# EAGLE design uC (EAGLE 7.7.0)
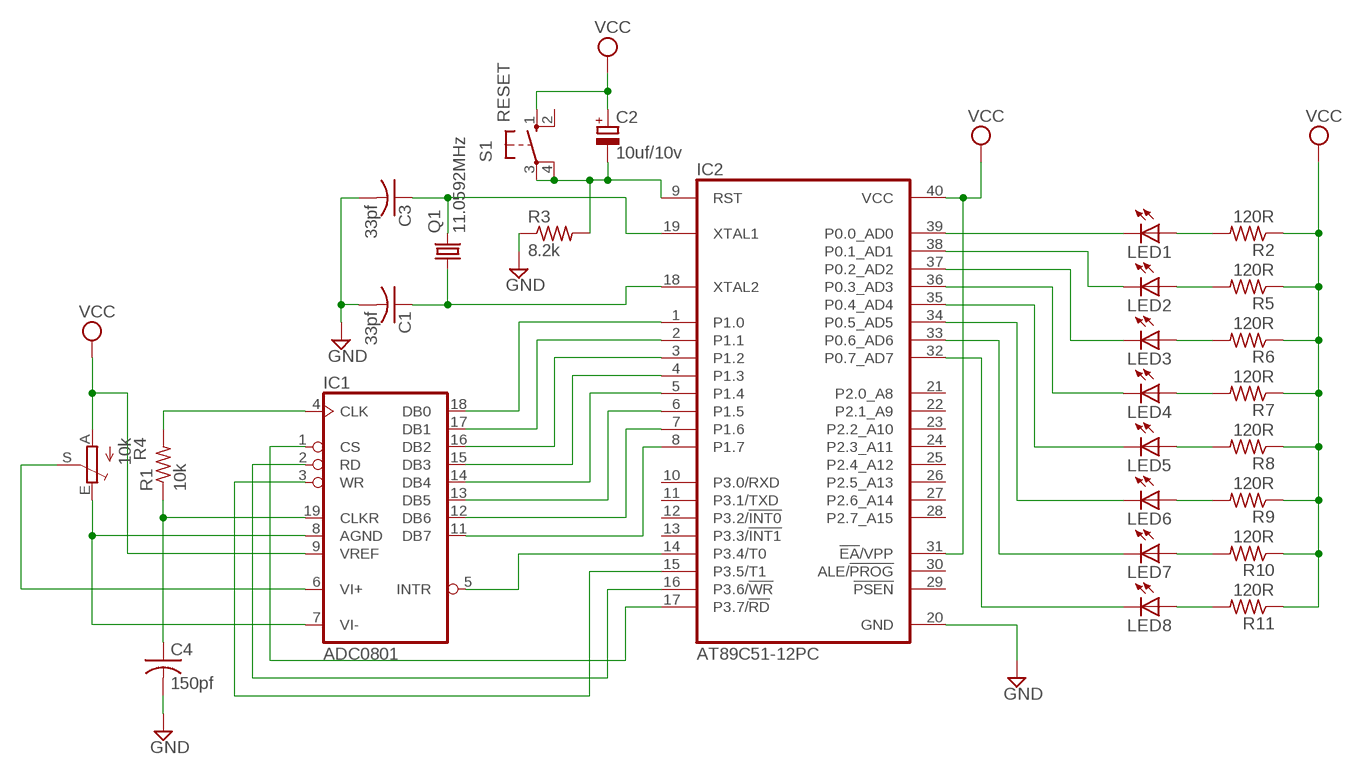
[diagram p0: schematic, sheet 1]

## Parts
C1  33pf  C-US025-025X050  [C025-025X050]
C2  10uf/10v  CPOL-EUE2.5-5  [E2,5-5]
C3  33pf  C-US025-025X050  [C025-025X050]
C4  150pf  C-US025-025X050  [C025-025X050]
IC1  ADC0801  [DIL20]
IC2  AT89C51-12PC  [DIL40]
LED1  LEDCHIPLED_0805  [CHIPLED_0805]
LED2  LEDCHIPLED_0805  [CHIPLED_0805]
LED3  LEDCHIPLED_0805  [CHIPLED_0805]
LED4  LEDCHIPLED_0805  [CHIPLED_0805]
LED5  LEDCHIPLED_0805  [CHIPLED_0805]
LED6  LEDCHIPLED_0805  [CHIPLED_0805]
LED7  LEDCHIPLED_0805  [CHIPLED_0805]
LED8  LEDCHIPLED_0805  [CHIPLED_0805]
Q1  11.0592MHz  CRYSTALTC26H  [TC26H]
R1  10k  R-US_R2512  [R2512]
R2  120R  R-US_R2512  [R2512]
R3  8.2k  R-US_R2512  [R2512]
R4  10k  TRIM_EU-B25U  [B25U]
R5  120R  R-US_R2512  [R2512]
R6  120R  R-US_R2512  [R2512]
R7  120R  R-US_R2512  [R2512]
R8  120R  R-US_R2512  [R2512]
R9  120R  R-US_R2512  [R2512]
R10  120R  R-US_R2512  [R2512]
R11  120R  R-US_R2512  [R2512]
S1  RESET  10-XX  [B3F-10XX]

## Nets
GND: C1.2 C3.2 C4.2 IC2.20(GND) R3.1
N$1: IC2.39(P0.0_AD0) LED1.C
N$2: IC2.38(P0.1_AD1) LED2.C
N$3: IC2.37(P0.2_AD2) LED3.C
N$4: IC2.36(P0.3_AD3) LED4.C
N$5: IC2.35(P0.4_AD4) LED5.C
N$6: IC2.34(P0.5_AD5) LED6.C
N$7: IC2.33(P0.6_AD6) LED7.C
N$8: IC2.32(P0.7_AD7) LED8.C
N$9: IC1.18(DB0) IC2.1(P1.0)
N$10: IC1.17(DB1) IC2.2(P1.1)
N$11: IC1.16(DB2) IC2.3(P1.2)
N$12: IC1.15(DB3) IC2.4(P1.3)
N$13: IC1.14(DB4) IC2.5(P1.4)
N$14: IC1.13(DB5) IC2.6(P1.5)
N$15: IC1.12(DB6) IC2.7(P1.6)
N$16: IC1.11(DB7) IC2.8(P1.7)
N$17: IC1.1(CS) IC2.17(P3.7/!RD)
N$18: IC1.2(RD) IC2.16(P3.6/!WR)
N$19: IC1.3(WR) IC2.15(P3.5/T1)
N$20: IC1.5(INTR) IC2.14(P3.4/T0)
N$21: IC1.6(VI+) R4.S
N$22: IC1.4(CLK) R1.2
N$23: IC1.7(VI-) IC1.8(AGND) R4.E
N$24: C4.1 IC1.19(CLKR) R1.1
N$25: C2.- IC2.9(RST) R3.2 S1.3(P) S1.4(P1)
N$26: LED1.A R2.2
N$27: LED2.A R5.2
N$28: C3.1 IC2.19(XTAL1) Q1.2
N$29: C1.1 IC2.18(XTAL2) Q1.1
N$30: LED3.A R6.2
N$31: LED4.A R7.2
N$32: LED5.A R8.2
N$33: LED6.A R9.2
N$34: LED7.A R10.2
N$35: LED8.A R11.2
VCC: C2.+ IC1.9(VREF) IC2.31(!EA!/VPP) IC2.40(VCC) R2.1 R4.A R5.1 R6.1 R7.1 R8.1 R9.1 R10.1 R11.1 S1.1(S)
Unconnected: IC2.10(P3.0/RXD) IC2.11(P3.1/TXD) IC2.12(P3.2/!INT0) IC2.13(P3.3/!INT1) IC2.21(P2.0_A8) IC2.22(P2.1_A9) IC2.23(P2.2_A10) IC2.24(P2.3_A11) IC2.25(P2.4_A12) IC2.26(P2.5_A13) IC2.27(P2.6_A14) IC2.28(P2.7_A15) IC2.29(!PSEN) IC2.30(ALE/!PROG) S1.2(S1)

## Power pins joined to a net without a drawn wire
GND: IC1.10(GND)
VCC: IC1.20(VCC)

## Library data of the parts
C1 C3 C4 = rcl:C-US: CAPACITOR, American symbol
C2 = rcl:CPOL-EU: POLARIZED CAPACITOR, European symbol
IC1 = linear:ADC0801: 8-bit A/D CONVERTER
IC2 = atmel:AT89C51-*: 8-bit Microcontroller with 4K Bytes Flash Not Recommended for New Designs. Use AT89S51. Source: http://www.atmel.com/dyn/resources/prod_documents/doc0265.; OC_FARNELL: unknown; OC_NEWARK: unknown
LED1-LED8 = led:LED: LED OSRAM: - CHIPLED LG R971, LG N971, LY N971, LG Q971, LY Q971, LO R971, LY R971 LH N974, LH R974 LS Q976, LO Q976, LY Q976 LO Q996 - Hyper CHIPLED LW Q18S LB Q993, LB Q99A, LB R99A - SideLED LS A670, LO A670, LY A670, LG A670, LP A670 LB A673, LV A673, LT A673, LW A673 LH A674 LY A675 LS A676, LA A676, LO A676, LY A676, LW A676 LS A679, LY A679, LG A679 - Hyper Micro SIDELED® LS Y876, LA Y876, LO Y876, LY Y876 LT Y87S - SmartLED LW L88C, LW L88S LB L89C, LB L89S, LG L890 LS L89K, LO L89K, LY L89K LS L896, LA L896, LO L896, LY L896 - TOPLED LS T670, LO T670, LY T670, LG T670, LP T670 LSG T670, LSP T670, LSY T670, LOP T670, LYG T670 LG T671, LOG T671, LSG T671 LB T673, LV T673, LT T673, LW T673 LH T674 LS T676, LA T676, LO T676, LY T676, LB T676, LH T676, LSB T676, LW T676 LB T67C, LV T67C, LT T67C, LS T67K, LO T67K, LY T67K, LW E67C LS E67B, LA E67B, LO E67B, LY E67B, LB E67C, LV E67C, LT E67C LW T67C LS T679, LY T679, LG T679 LS T770, LO T770, LY T770, LG T770, LP T770 LB T773, LV T773, LT T773, LW T773 LH T774 LS E675, LA E675, LY E675, LS T675 LS T776, LA T776, LO T776, LY T776, LB T776 LHGB T686 LT T68C, LB T68C - Hyper Mini TOPLED® LB M676 - Mini TOPLED Santana® LG M470 LS M47K, LO M47K, LY M47K Source: http://www.osram.convergy.de LUXEON: - LUMILED® LXK2-PW12-R00, LXK2-PW12-S00, LXK2-PW14-U00, LXK2-PW14-V00 LXK2-PM12-R00, LXK2-PM12-S00, LXK2-PM14-U00 LXK2-PE12-Q00, LXK2-PE12-R00, LXK2-PE12-S00, LXK2-PE14-T00, LXK2-PE14-U00 LXK2-PB12-K00, LXK2-PB12-L00, LXK2-PB12-M00, LXK2-PB14-N00, LXK2-PB14-P00, LXK2-PB14-Q00 LXK2-PR12-L00, LXK2-PR12-M00, LXK2-PR14-Q00, LXK2-PR14-R00 LXK2-PD12-Q00, LXK2-PD12-R00, LXK2-PD12-S00 LXK2-PH12-R00, LXK2-PH12-S00 LXK2-PL12-P00, LXK2-PL12-Q00, LXK2-PL12-R00 Source: www.luxeon.com KINGBRIGHT: KA-3528ASYC Source: www.kingbright.com
Q1 = crystal:CRYSTAL: CRYSTAL; OC_FARNELL: unknown; OC_NEWARK: unknown
R1-R3 R5-R11 = rcl:R-US_: RESISTOR, American symbol
R4 = pot:TRIM_EU-: POTENTIOMETER
S1 = switch-omron:10-XX: OMRON SWITCH; MPN: B3F-1000; OC_FARNELL: 176432; OC_NEWARK: 36M3542

## Board
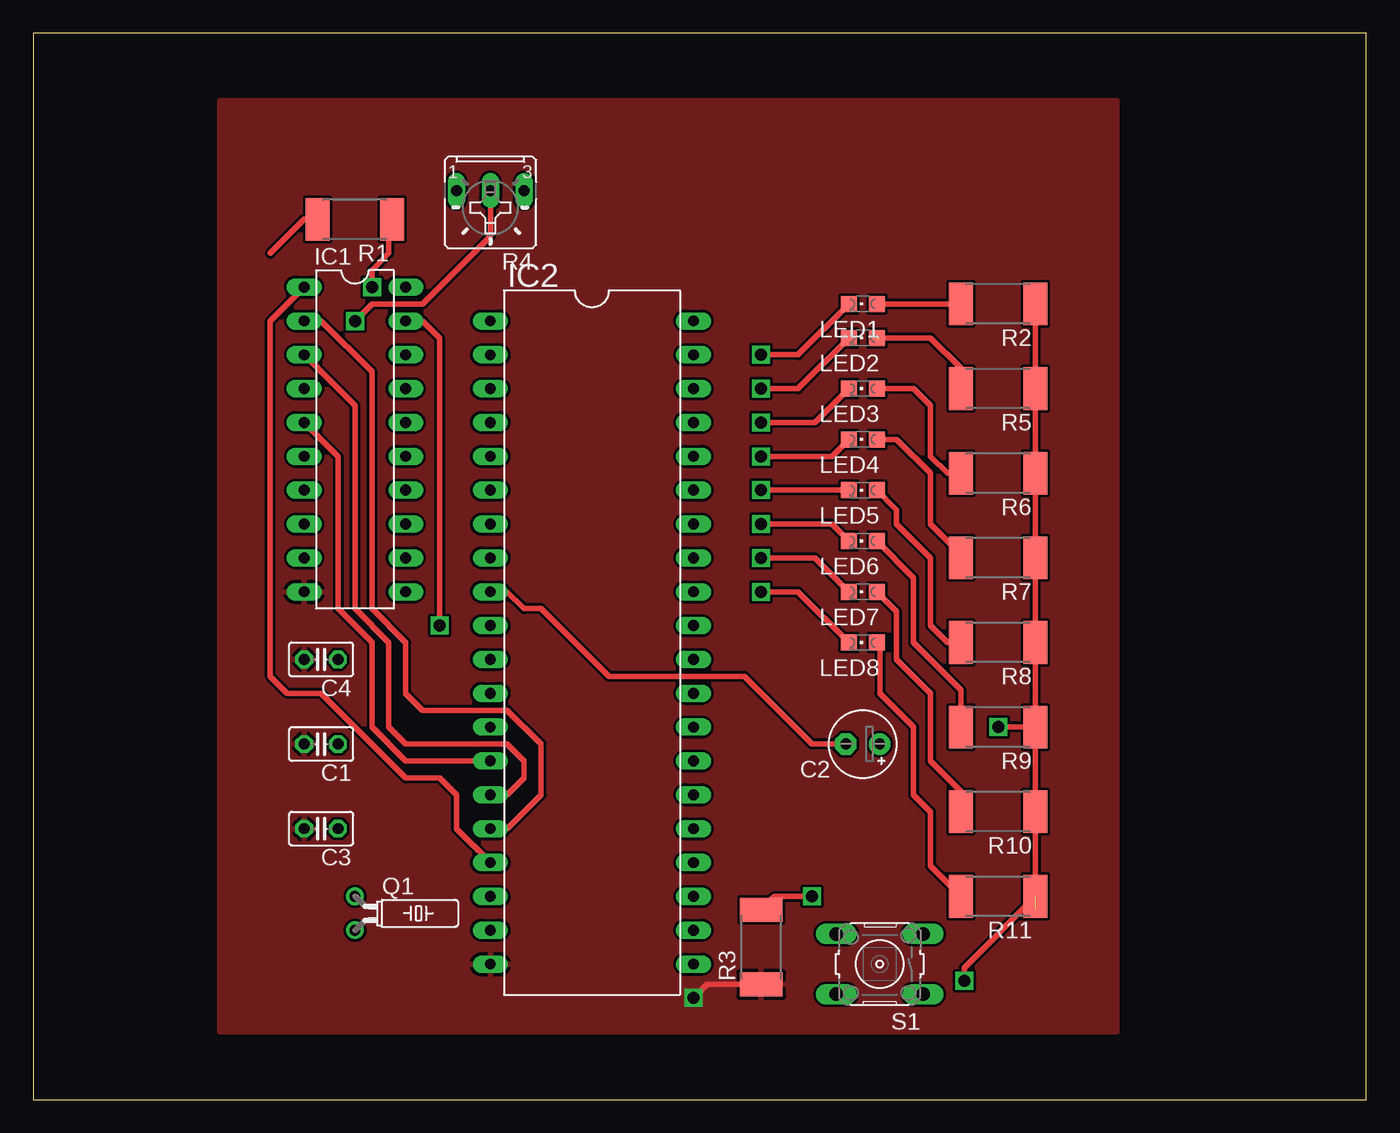
[diagram p1: board, top side]
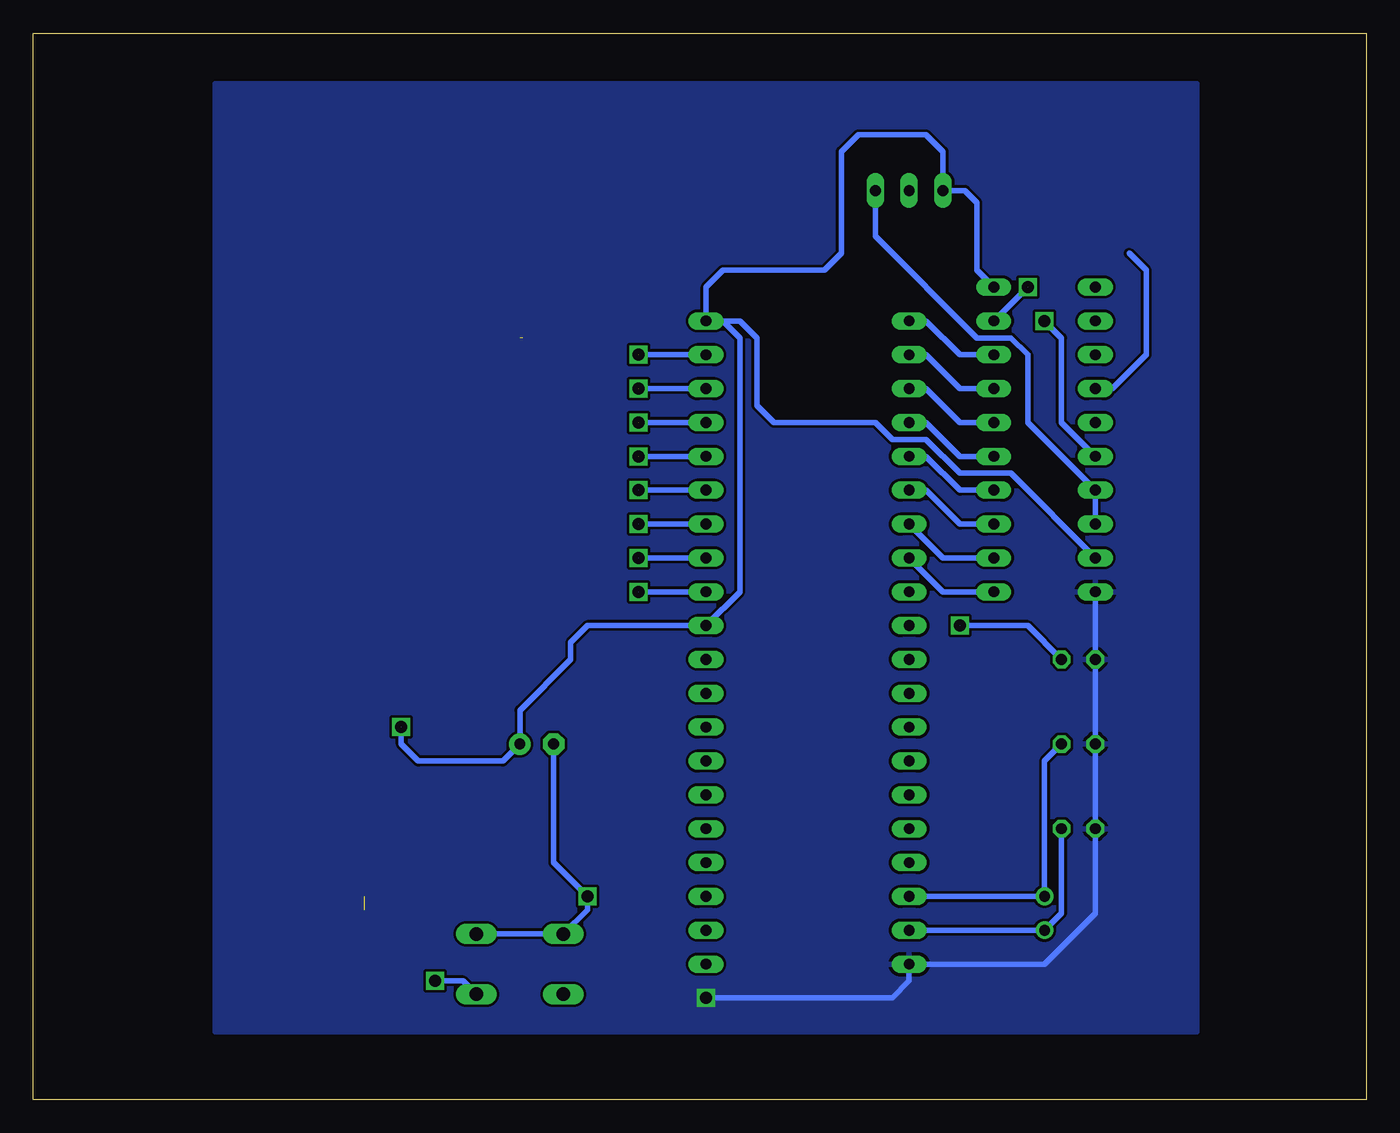
[diagram p2: board, bottom side, seen from below]

Size 100 x 80 mm. Coordinates in mm from the lower left corner, seen from the top.
Outline: 0,0 100,0 100,80 0,80 0,0
Copper layers (1*16): Top 0.035mm / dielectric 1.5mm / Bottom 0.035mm
Design rules "default": minimum track width 10mil, minimum drill 24mil, track to track 8mil, track to pad 8mil, pad to pad 8mil, via to via 8mil, smd to smd 8mil, copper to edge 40mil, drill to drill 8mil, minimum pad ring 10mil, minimum via ring 8mil, stop-mask expansion 4mil, vias tented up to drill 0mil, thermal gap 10mil

### Footprints (pad centres in the part's own frame; a part is rotated, then mirrored left to right if it is on the bottom)
C025-025X050 = drill 0.813 octagon: 1 -1.27,0; 2 1.27,0
E2,5-5 = drill 0.813 pad 1.6: + -1.27,0 | drill 0.813 pad 1.6 octagon: - 1.27,0
DIL20 = drill 0.813 long: 1 -11.43,-3.81; 2 -8.89,-3.81; 3 -6.35,-3.81; 4 -3.81,-3.81; 5 -1.27,-3.81; 6 1.27,-3.81; 7 3.81,-3.81; 8 6.35,-3.81; 9 8.89,-3.81; 10 11.43,-3.81; 11 11.43,3.81; 12 8.89,3.81; 13 6.35,3.81; 14 3.81,3.81; 15 1.27,3.81; 16 -1.27,3.81; 17 -3.81,3.81; 18 -6.35,3.81; 19 -8.89,3.81; 20 -11.43,3.81
DIL40 = drill 0.813 long: 1 -24.13,-7.62; 2 -21.59,-7.62; 3 -19.05,-7.62; 4 -16.51,-7.62; 5 -13.97,-7.62; 6 -11.43,-7.62; 7 -8.89,-7.62; 8 -6.35,-7.62; 9 -3.81,-7.62; 10 -1.27,-7.62; 11 1.27,-7.62; 12 3.81,-7.62; 13 6.35,-7.62; 14 8.89,-7.62; 15 11.43,-7.62; 16 13.97,-7.62; 17 16.51,-7.62; 18 19.05,-7.62; 19 21.59,-7.62; 20 24.13,-7.62; 21 24.13,7.62; 22 21.59,7.62; 23 19.05,7.62; 24 16.51,7.62; 25 13.97,7.62; 26 11.43,7.62; 27 8.89,7.62; 28 6.35,7.62; 29 3.81,7.62; 30 1.27,7.62; 31 -1.27,7.62; 32 -3.81,7.62; 33 -6.35,7.62; 34 -8.89,7.62; 35 -11.43,7.62; 36 -13.97,7.62; 37 -16.51,7.62; 38 -19.05,7.62; 39 -21.59,7.62; 40 -24.13,7.62
CHIPLED_0805 = smd 1.2 x 1.2: A 0,-1.05; C 0,1.05
TC26H = drill 0.813: 1 -1.27,0; 2 1.27,0
R2512 = smd 1.8 x 3.2: 1 -2.8,0; 2 2.8,0
B25U = drill 0.813 long: A 2.54,-0.889; E -2.54,-0.889; S 0,-0.889
B3F-10XX = drill 1.016 long: 1 -3.251,2.261; 2 3.251,2.261; 3 -3.251,-2.261; 4 3.251,-2.261

### Placement (x,y rotation side)
C1  21.59,26.67 180 top
C2  62.23,26.67 180 top
C3  21.59,20.32 180 top
C4  21.59,33.02 180 top
IC1  24.13,49.53 270 top
IC2  41.91,34.29 270 top
LED1  62.23,59.69 90 top
LED2  62.23,57.15 90 top
LED3  62.23,53.34 90 top
LED4  62.23,49.53 90 top
LED5  62.23,45.72 90 top
LED6  62.23,41.91 90 top
LED7  62.23,38.1 90 top
LED8  62.23,34.29 90 top
Q1  24.13,13.97 270 top
R1  24.13,66.04 180 top
R2  72.39,59.69 180 top
R3  54.61,11.43 90 top
R4  34.29,67.31 180 top
R5  72.39,53.34 180 top
R6  72.39,46.99 180 top
R7  72.39,40.64 180 top
R8  72.39,34.29 180 top
R9  72.39,27.94 180 top
R10  72.39,21.59 180 top
R11  72.39,15.24 180 top
S1  63.5,10.16 180 top

### Tracks (layer width: path | path; a pad name or v marks a point on that pad's centre or on a via)
GND  (via drill 0.9)
  Top 0.406: R3.1 50.54,8.63 v49.53,7.62
  Bottom 0.406: v49.53,7.62 35.56,7.62 34.29,8.89 IC2.20 24.13,10.16 20.32,13.97 C3.2 C1.2 C4.2 IC1.10
  pour Bottom: 12.7,76.2 86.36,76.2 86.36,5.08 12.7,5.08
  pour Top: 13.97,74.93 81.28,74.93 81.28,5.08 13.97,5.08
N$1  (via drill 0.9)  (1 unrouted)
  Top 0.406: LED1.C 57.37,55.88 v54.61,55.88
  Bottom 0.406: IC2.39 v54.61,55.88
N$2  (via drill 0.9)  (1 unrouted)
  Top 0.406: LED2.C 57.37,53.34 v54.61,53.34
  Bottom 0.406: IC2.38 v54.61,53.34
N$3  (via drill 0.9)  (1 unrouted)
  Top 0.406: LED3.C 58.64,50.8 v54.61,50.8
  Bottom 0.406: IC2.37 v54.61,50.8
N$4  (via drill 0.9)  (1 unrouted)
  Top 0.406: LED4.C 59.91,48.26 v54.61,48.26
  Bottom 0.406: IC2.36 v54.61,48.26
N$5  (via drill 0.9)  (2 unrouted)
  Top 0.406: LED5.C v54.61,45.72
  Bottom 0.406: IC2.35 v54.61,45.72
N$6  (via drill 0.9)  (1 unrouted)
  Top 0.406: LED6.C 59.91,43.18 v54.61,43.18
  Bottom 0.406: IC2.34 v54.61,43.18
N$7  (via drill 0.9)  (3 unrouted)
  Top 0.406: LED7.C 58.64,40.64 v54.61,40.64
  Bottom 0.406: IC2.33 v54.61,40.64
N$8  (via drill 0.9)  (1 unrouted)
  Top 0.406: LED8.C 57.37,38.1 v54.61,38.1
  Bottom 0.406: IC2.32 v54.61,38.1
N$9
  Bottom 0.406: IC1.18 30.48,55.88 33.02,58.42 IC2.1
N$10
  Bottom 0.406: IC1.17 30.48,53.34 33.02,55.88 IC2.2
N$11
  Bottom 0.406: IC1.16 30.48,50.8 33.02,53.34 IC2.3
N$12
  Bottom 0.406: IC1.15 30.48,48.26 33.02,50.8 IC2.4
N$13
  Bottom 0.406: IC1.14 30.48,45.72 33.02,48.26 IC2.5
N$14
  Bottom 0.406: IC1.13 30.48,43.18 33.02,45.72 IC2.6
N$15
  Bottom 0.406: IC1.12 31.75,40.64 IC2.7
N$16
  Bottom 0.406: IC2.8 31.75,38.1 IC1.11
N$17
  Top 0.406: IC2.17 31.75,20.32 31.75,22.86 30.48,24.13 27.94,24.13 21.59,30.48 19.05,30.48 17.78,31.75 17.78,58.42 IC1.1
N$18
  Top 0.406: IC2.16 35.56,20.32 38.1,22.86 38.1,26.67 35.56,29.21 29.21,29.21 27.94,30.48 27.94,34.29 25.4,36.83 25.4,54.61 21.59,58.42 IC1.2
N$19
  Top 0.406: IC2.15 35.56,22.86 36.83,24.13 36.83,25.4 35.56,26.67 27.94,26.67 26.67,27.94 26.67,34.29 24.13,36.83 24.13,52.07 IC1.3
N$20
  Top 0.406: IC1.5 22.86,48.26 22.86,36.83 25.4,34.29 25.4,27.94 27.94,25.4 IC2.14
N$21  (via drill 0.9)
  Top 0.406: R4.S 34.29,64.77 29.21,59.69 25.4,59.69 v24.13,58.42
  Bottom 0.406: IC1.6 22.86,50.8 22.86,57.15 v24.13,58.42
N$22  (2 unrouted)
  Top 0.406: R1.2 20.32,66.04 17.78,63.5
  Bottom 0.406: IC1.4 19.05,53.34 16.51,55.88 16.51,62.23 17.78,63.5
N$23
  Bottom 0.406: R4.E 36.83,64.77 29.21,57.15 26.67,57.15 25.4,55.88 25.4,50.8 IC1.7 IC1.8
N$24  (via drill 0.9)  (4 unrouted)
  Top 0.406: R1.1 26.67,65.78 26.67,63.5 25.4,62.23 v25.4,60.96 | IC1.19 29.21,58.42 30.48,57.15 v30.48,35.56
  Bottom 0.406: IC1.19 v25.4,60.96 | C4.1 25.4,35.56 v30.48,35.56
N$25  (via drill 0.9)
  Top 0.406: R3.2 55.62,15.24 v58.42,15.24 | C2.- 58.42,26.67 53.34,31.75 43.18,31.75 38.1,36.83 36.83,36.83 35.56,38.1 IC2.9
  Bottom 0.406: S1.3 S1.4 58.42,14.25 v58.42,15.24 60.96,17.78 C2.-
N$26
  Top 0.406: R2.2 LED1.A
N$27  (1 unrouted)
  Top 0.406: R5.2 69.59,54.87 67.31,57.15 63.5,57.15
N$28
  Bottom 0.406: IC2.19 Q1.2 22.86,13.97 C3.1
N$29
  Bottom 0.406: IC2.18 Q1.1 24.13,25.4 C1.1
N$30
  Top 0.406: R6.2 68.58,46.99 67.31,48.26 67.31,52.07 66.04,53.34 LED3.A
N$31
  Top 0.406: LED4.A 64.77,49.53 67.31,46.99 67.31,43.18 69.59,40.9 R7.2
N$32
  Top 0.406: LED5.A 64.77,44.23 64.77,43.18 67.31,40.64 67.31,35.56 68.58,34.29 R8.2
N$33
  Top 0.406: LED6.A 66.04,39.15 66.04,34.29 69.59,30.74 R9.2
N$34
  Top 0.406: LED7.A 64.77,36.61 64.77,33.02 67.31,30.48 67.31,25.4 69.59,23.12 R10.2
N$35
  Top 0.406: LED8.A 63.5,34.07 63.5,30.48 66.04,27.94 66.04,22.86 67.31,21.59 67.31,17.52 R11.2
N$36  (1 unrouted)
N$37  (1 unrouted)
N$38  (1 unrouted)
N$39  (1 unrouted)
N$40  (1 unrouted)
N$41  (1 unrouted)
N$42  (1 unrouted)
N$43  (1 unrouted)
N$45  (1 unrouted)
N$47  (1 unrouted)
N$49  (1 unrouted)
VCC  (via drill 0.9)  (3 unrouted)
  Top 0.406: R11.1 69.85,9.9 v69.85,8.89 | R9.1 R10.1 75.19,14.23 74.93,13.97 | R9.1 R8.1 R7.1 R6.1 R5.1 R2.1 | R9.1 v72.39,27.94
  Bottom 0.406: S1.1 67.74,8.89 v69.85,8.89 | IC2.40 48.26,58.42 46.99,57.15 46.99,38.1 IC2.31 58.42,35.56 59.69,34.29 59.69,33.02 63.5,29.21 C2.+ 64.77,25.4 71.12,25.4 72.39,26.67 v72.39,27.94 | IC2.40 49.53,60.96 48.26,62.23 40.64,62.23 39.37,63.5 39.37,71.12 38.1,72.39 33.02,72.39 31.75,71.12 R4.A 30.1,68.2 29.21,67.31 29.21,62.23 IC1.20 | IC1.9 26.67,46.99 30.48,46.99 33.02,49.53 35.56,49.53 36.83,50.8 44.45,50.8 45.72,52.07 45.72,57.15 46.99,58.42 IC2.40